# Altium schematic sheet Block Diagram.SchDoc
size A4; SheetNumber: 1; SheetTotal: 8
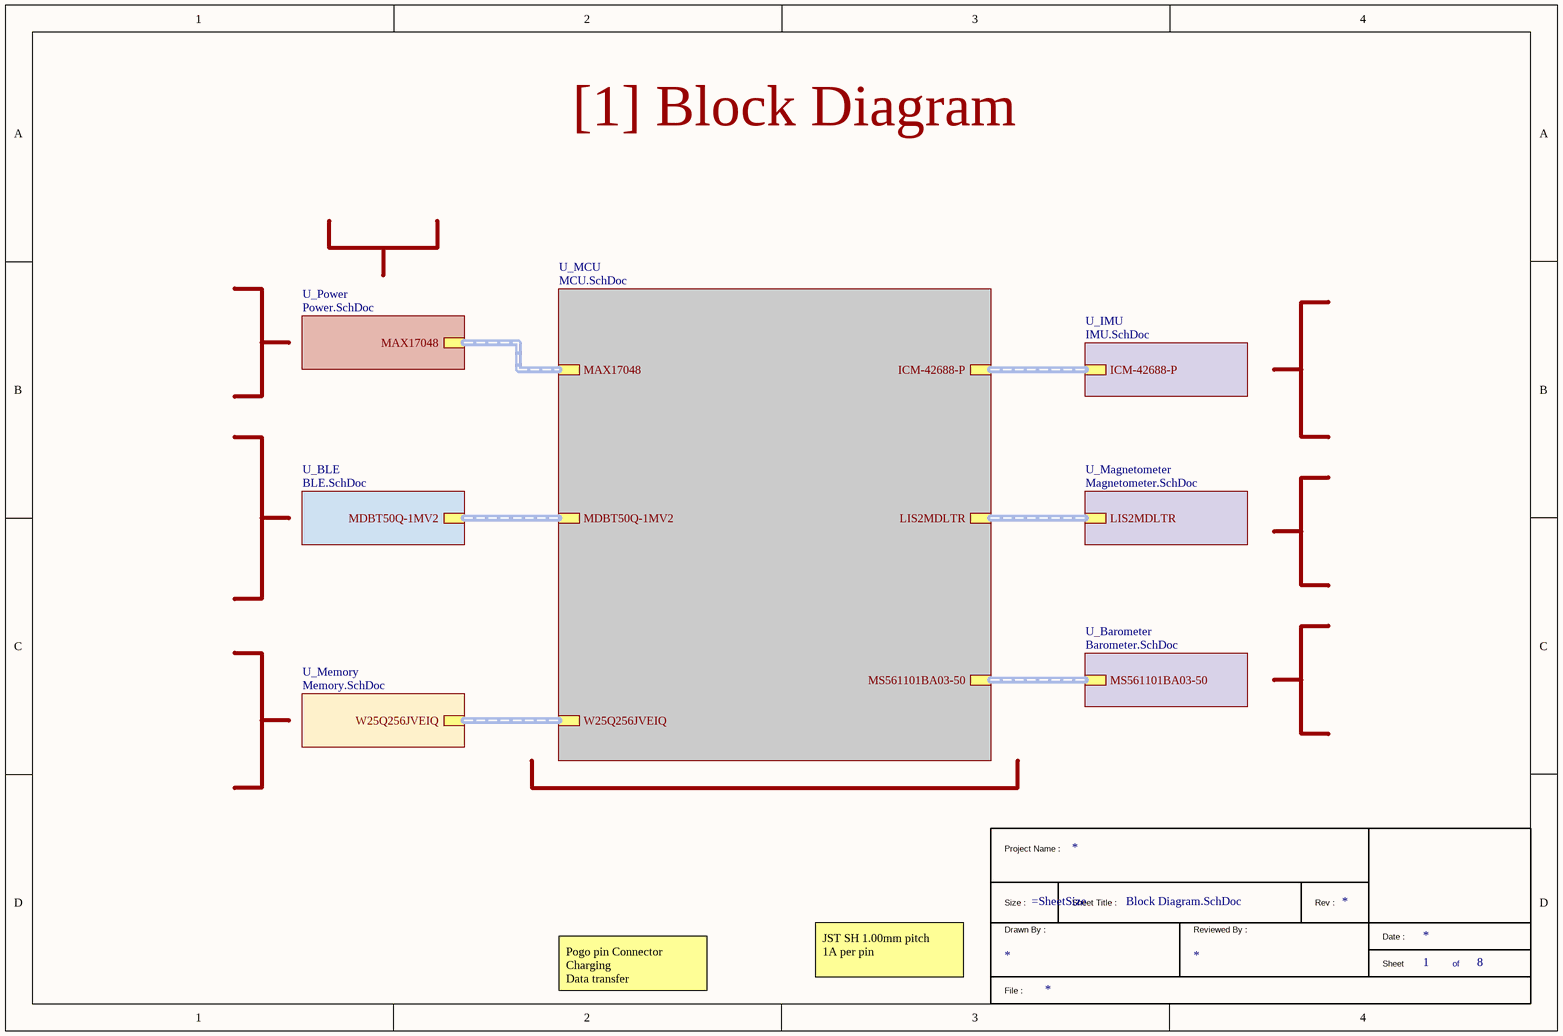
[diagram p0: Block Diagram.SchDoc]

## Parts
*  TitleBlock1  (value not drawn)  (graphical)

## Sub-sheets
U_Barometer = Barometer.SchDoc: MS561101BA03-50 (harness Barometer)
U_BLE = BLE.SchDoc: MDBT50Q-1MV2 (harness BLE)
U_IMU = IMU.SchDoc: ICM-42688-P (harness *)
U_Magnetometer = Magnetometer.SchDoc: LIS2MDLTR (harness Magnetometer)
U_MCU = MCU.SchDoc: ICM-42688-P (harness IMU), W25Q256JVEIQ (harness Memory), MAX17048 (harness Fuel gauge), LIS2MDLTR (harness Magnetometer), MS561101BA03-50 (harness Barometer), MDBT50Q-1MV2 (harness BLE)
U_Memory = Memory.SchDoc: W25Q256JVEIQ (harness Memory)
U_Power = Power.SchDoc: MAX17048 (harness Fuel gauge)

## Buses and harness runs
harness sheet U_Barometer/MS561101BA03-50 = sheet U_MCU/MS561101BA03-50
harness sheet U_BLE/MDBT50Q-1MV2 = sheet U_MCU/MDBT50Q-1MV2
harness sheet U_IMU/ICM-42688-P = sheet U_MCU/ICM-42688-P
harness sheet U_Magnetometer/LIS2MDLTR = sheet U_MCU/LIS2MDLTR
harness sheet U_MCU/MAX17048 = sheet U_Power/MAX17048
harness sheet U_MCU/W25Q256JVEIQ = sheet U_Memory/W25Q256JVEIQ

## Notes on the sheet
- [1] Block Diagram
- Pogo pin Connector
  Charging
  Data transfer
- (near *) JST SH 1.00mm pitch
  1A per pin
- (in symbol TitleBlock1) Project Name :; Size :; Sheet Title :; Rev :; Drawn By :; Reviewed By :; Date :; Sheet; of; File :